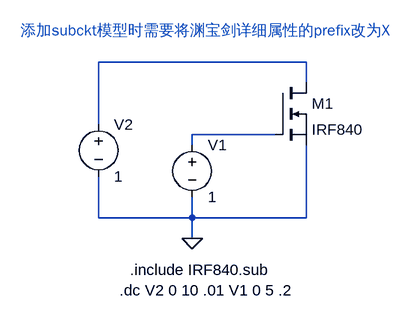
[diagram p0: schematic Draft1.asc]
Draft1.asc, the LTspice schematic file:
Version 4.1
SHEET 1 880 680
WIRE 0 0 -320 0
WIRE 0 32 0 0
WIRE -320 96 -320 0
WIRE -48 112 -176 112
WIRE -176 128 -176 112
WIRE -320 240 -320 176
WIRE -176 240 -176 208
WIRE -176 240 -320 240
WIRE 0 240 0 128
WIRE 0 240 -176 240
WIRE -176 272 -176 240
FLAG -176 272 0
SYMBOL nmos -48 32 R0
SYMATTR InstName M1
SYMATTR Value IRF840
SYMATTR Prefix X
SYMBOL voltage -176 112 R0
WINDOW 123 0 0 Left 0
WINDOW 39 0 0 Left 0
SYMATTR InstName V1
SYMATTR Value 1
SYMBOL voltage -320 80 R0
SYMATTR InstName V2
SYMATTR Value 1
TEXT -272 320 Left 2 !.include IRF840.sub
TEXT -288 352 Left 2 !.dc V2 0 10 .01 V1 0 5 .2
TEXT -440 -48 Left 2 ;添加subckt模型时需要将渊宝剑详细属性的prefix改为X

The netlist it stands for:
* Draft1.asc
X§M1 N001 N002 0 IRF840  ; pins D G S
V1 N002 0 1
V2 N001 0 1
.include IRF840.sub
.dc V2 0 10 .01 V1 0 5 .2
* 添加subckt模型时需要将渊宝剑详细属性的prefix改为X
.backanno
.end